# EAGLE design main_board_2_layers_v2 (EAGLE 7.4.0)
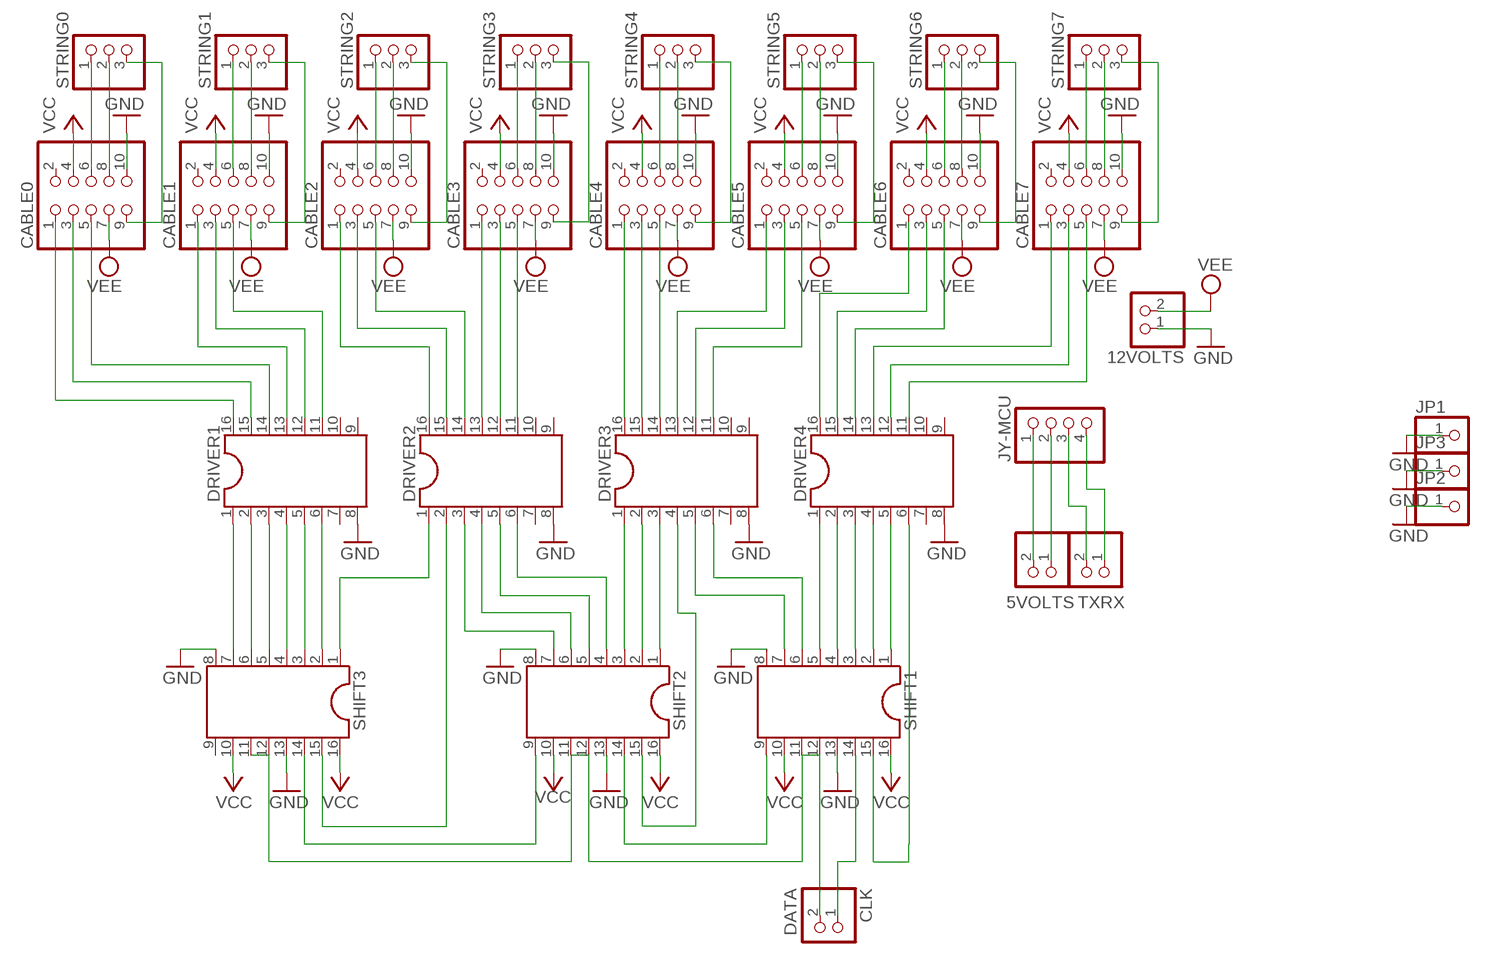
[diagram p0: schematic, sheet 1]

## Parts
5VOLTS  PINHD-1X2  [1X02]
12VOLTS  PINHD-1X2  [1X02]
CABLE0  PINHD-2X5  [2X05]
CABLE1  PINHD-2X5  [2X05]
CABLE2  PINHD-2X5  [2X05]
CABLE3  PINHD-2X5  [2X05]
CABLE4  PINHD-2X5  [2X05]
CABLE5  PINHD-2X5  [2X05]
CABLE6  PINHD-2X5  [2X05]
CABLE7  PINHD-2X5  [2X05]
CLK  DATA  PINHD-1X2  [1X02]
DRIVER1  DIL16  [DIL16]
DRIVER2  DIL16  [DIL16]
DRIVER3  DIL16  [DIL16]
DRIVER4  DIL16  [DIL16]
JP1  PINHD-1X1  [1X01]
JP2  PINHD-1X1  [1X01]
JP3  PINHD-1X1  [1X01]
JY-MCU  PINHD-1X4  [1X04]
SHIFT1  DIL16  [DIL16]
SHIFT2  DIL16  [DIL16]
SHIFT3  DIL16  [DIL16]
STRING0  PINHD-1X3  [1X03]
STRING1  PINHD-1X3  [1X03]
STRING2  PINHD-1X3  [1X03]
STRING3  PINHD-1X3  [1X03]
STRING4  PINHD-1X3  [1X03]
STRING5  PINHD-1X3  [1X03]
STRING6  PINHD-1X3  [1X03]
STRING7  PINHD-1X3  [1X03]
TXRX  PINHD-1X2  [1X02]

## Nets
GND: 12VOLTS.1 CABLE0.10 CABLE1.10 CABLE2.10 CABLE3.10 CABLE4.10 CABLE5.10 CABLE6.10 CABLE7.10 DRIVER1.8 DRIVER2.8 DRIVER3.8 DRIVER4.8 JP1.1 JP2.1 JP3.1 SHIFT1.8 SHIFT1.13 SHIFT2.8 SHIFT2.13 SHIFT3.8 SHIFT3.13
N$1: CABLE0.1 DRIVER1.16
N$2: CABLE0.3 DRIVER1.15
N$3: CABLE0.5 DRIVER1.14
N$4: CABLE1.1 DRIVER1.13
N$5: CABLE1.3 DRIVER1.12
N$6: CABLE1.5 DRIVER1.11
N$7: CABLE2.1 DRIVER2.16
N$8: CABLE2.3 DRIVER2.15
N$9: CABLE2.5 DRIVER2.14
N$10: CABLE3.1 DRIVER2.13
N$11: CABLE3.3 DRIVER2.12
N$12: CABLE3.5 DRIVER2.11
N$13: CABLE4.1 DRIVER3.16
N$14: CABLE4.3 DRIVER3.15
N$15: CABLE4.5 DRIVER3.14
N$16: CABLE5.1 DRIVER3.13
N$17: CABLE5.3 DRIVER3.12
N$18: CABLE5.5 DRIVER3.11
N$19: CABLE6.1 DRIVER4.16
N$20: CABLE6.3 DRIVER4.15
N$21: CABLE7.1 DRIVER4.13
N$22: CABLE6.5 DRIVER4.14
N$23: CABLE7.3 DRIVER4.12
N$24: CABLE7.5 DRIVER4.11
N$25: DRIVER4.6
N$26: DRIVER4.5 SHIFT1.1
N$27: DRIVER4.4 SHIFT1.2
N$28: CABLE1.9 STRING1.3
N$29: CABLE0.6 STRING0.1
N$30: CABLE0.9 STRING0.3
N$31: CABLE0.8 STRING0.2
N$32: CABLE7.6 STRING7.1
N$33: CABLE7.8 STRING7.2
N$34: CABLE1.6 STRING1.1
N$35: CABLE1.8 STRING1.2
N$36: CABLE7.9 STRING7.3
N$37: CABLE2.8 STRING2.2
N$38: CABLE2.6 STRING2.1
N$39: CABLE3.9 STRING3.3
N$40: CABLE3.8 STRING3.2
N$41: CABLE3.6 STRING3.1
N$42: CABLE4.9 STRING4.3
N$43: CABLE4.8 STRING4.2
N$44: CABLE4.6 STRING4.1
N$45: CABLE5.9 STRING5.3
N$46: CABLE5.6 STRING5.1
N$47: CABLE5.8 STRING5.2
N$48: CABLE6.9 STRING6.3
N$49: CABLE6.6 STRING6.1
N$50: CABLE6.8 STRING6.2
N$51: SHIFT1.15
N$52: DRIVER4.3 SHIFT1.3
N$53: DRIVER4.2 SHIFT1.4
N$54: DRIVER4.1 SHIFT1.5
N$55: DRIVER3.6 SHIFT1.6
N$56: DRIVER3.5 SHIFT1.7
N$57: DRIVER3.4 SHIFT2.15
N$58: DRIVER3.3 SHIFT2.1
N$59: DRIVER3.2 SHIFT2.2
N$60: DRIVER3.1 SHIFT2.3
N$61: DRIVER2.6 SHIFT2.4
N$62: DRIVER2.5 SHIFT2.5
N$63: DRIVER2.4 SHIFT2.6
N$64: DRIVER2.3 SHIFT2.7
N$65: DRIVER2.2 SHIFT3.15
N$66: DRIVER2.1 SHIFT3.1
N$67: DRIVER1.1 SHIFT3.7
N$69: DRIVER1.2 SHIFT3.6
N$70: DRIVER1.3 SHIFT3.5
N$71: DRIVER1.4 SHIFT3.4
N$72: DRIVER1.5 SHIFT3.3
N$73: DRIVER1.6 SHIFT3.2
N$81: 5VOLTS.2 JY-MCU.1
N$82: 5VOLTS.1 JY-MCU.2
N$83: JY-MCU.3 TXRX.2
N$101: SHIFT1.9 SHIFT2.14
N$102: SHIFT2.9 SHIFT3.14
N$106: CLK.1 SHIFT1.14
N$107: CLK.2 SHIFT1.11 SHIFT1.12 SHIFT2.11 SHIFT2.12 SHIFT3.11 SHIFT3.12
N$118: CABLE2.9 STRING2.3
N$119: JY-MCU.4 TXRX.1
VCC: CABLE0.4 CABLE1.4 CABLE2.4 CABLE3.4 CABLE4.4 CABLE5.4 CABLE6.4 CABLE7.4 SHIFT1.10 SHIFT1.16 SHIFT2.10 SHIFT2.16 SHIFT3.10 SHIFT3.16
VEE: 12VOLTS.2 CABLE0.7 CABLE1.7 CABLE2.7 CABLE3.7 CABLE4.7 CABLE5.7 CABLE6.7 CABLE7.7
Unconnected: CABLE0.2 CABLE1.2 CABLE2.2 CABLE3.2 CABLE4.2 CABLE5.2 CABLE6.2 CABLE7.2 DRIVER1.7 DRIVER1.9 DRIVER1.10 DRIVER2.7 DRIVER2.9 DRIVER2.10 DRIVER3.7 DRIVER3.9 DRIVER3.10 DRIVER4.7 DRIVER4.9 DRIVER4.10 SHIFT3.9

## Library data of the parts
5VOLTS 12VOLTS CLK TXRX = pinhead:PINHD-1X2: PIN HEADER
CABLE0 CABLE1-CABLE7 = pinhead:PINHD-2X5: PIN HEADER
DRIVER1-DRIVER4 SHIFT1-SHIFT3 = ic-package:DIL16: Dual In Line / Socket
JP1-JP3 = adafruit:PINHD-1X1: Pin header 1x1 for 0.1" spacing With round pins
JY-MCU = pinhead:PINHD-1X4: PIN HEADER
STRING0 STRING1-STRING7 = pinhead:PINHD-1X3: PIN HEADER

## Net classes
0 default: width 1 mm, drill 1.1 mm, clearance 1 mm

## Board
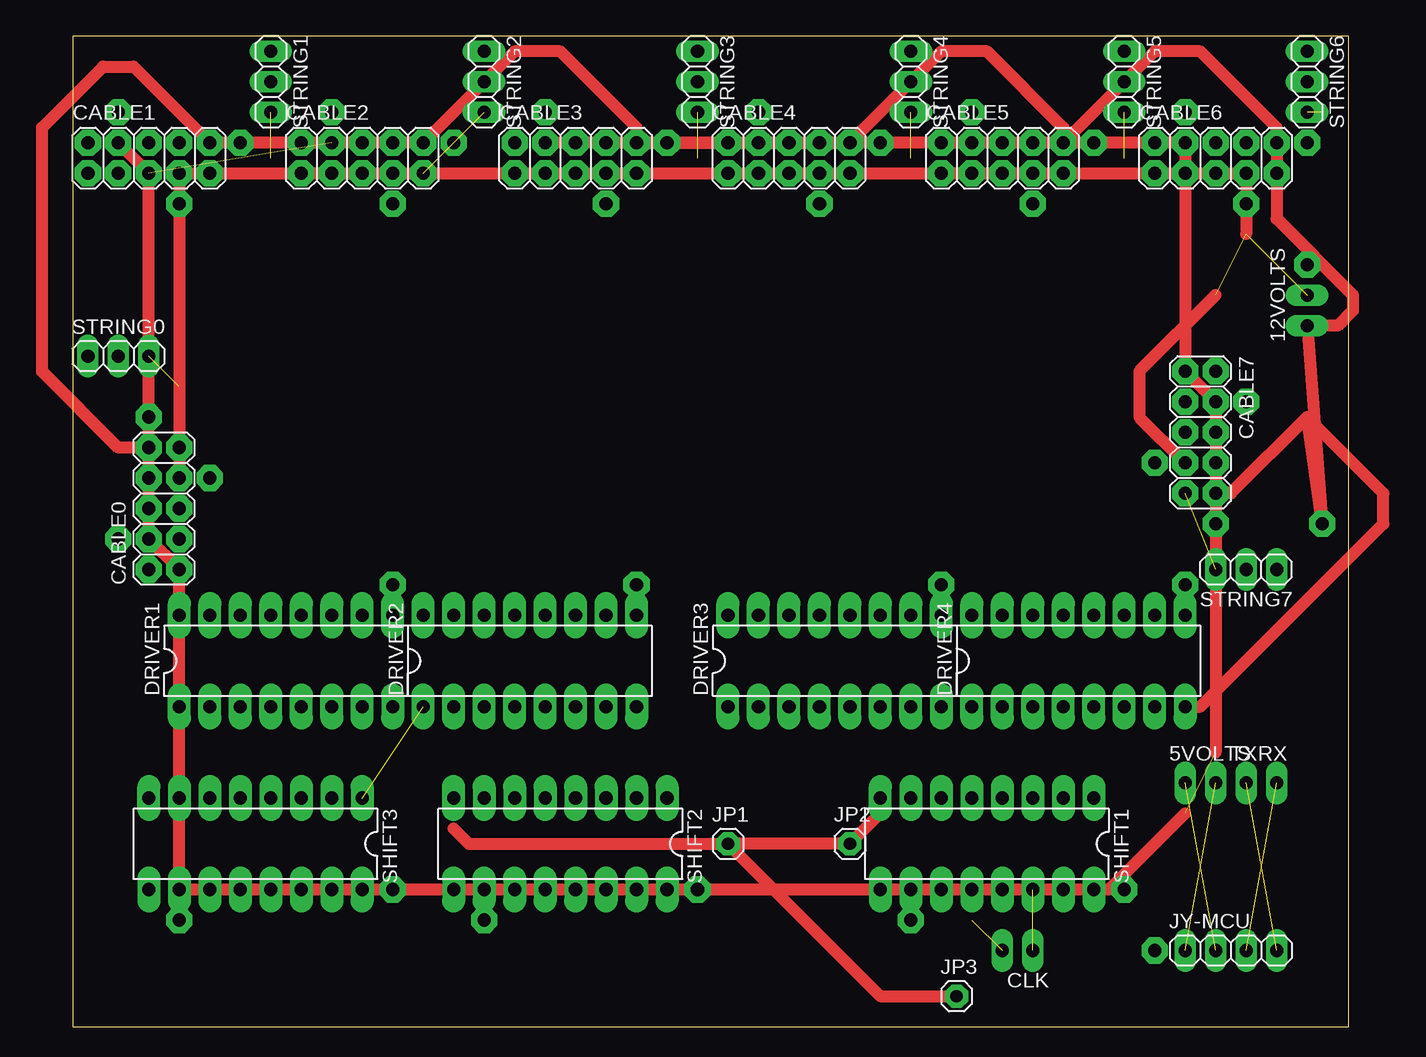
[diagram p1: board, top side]
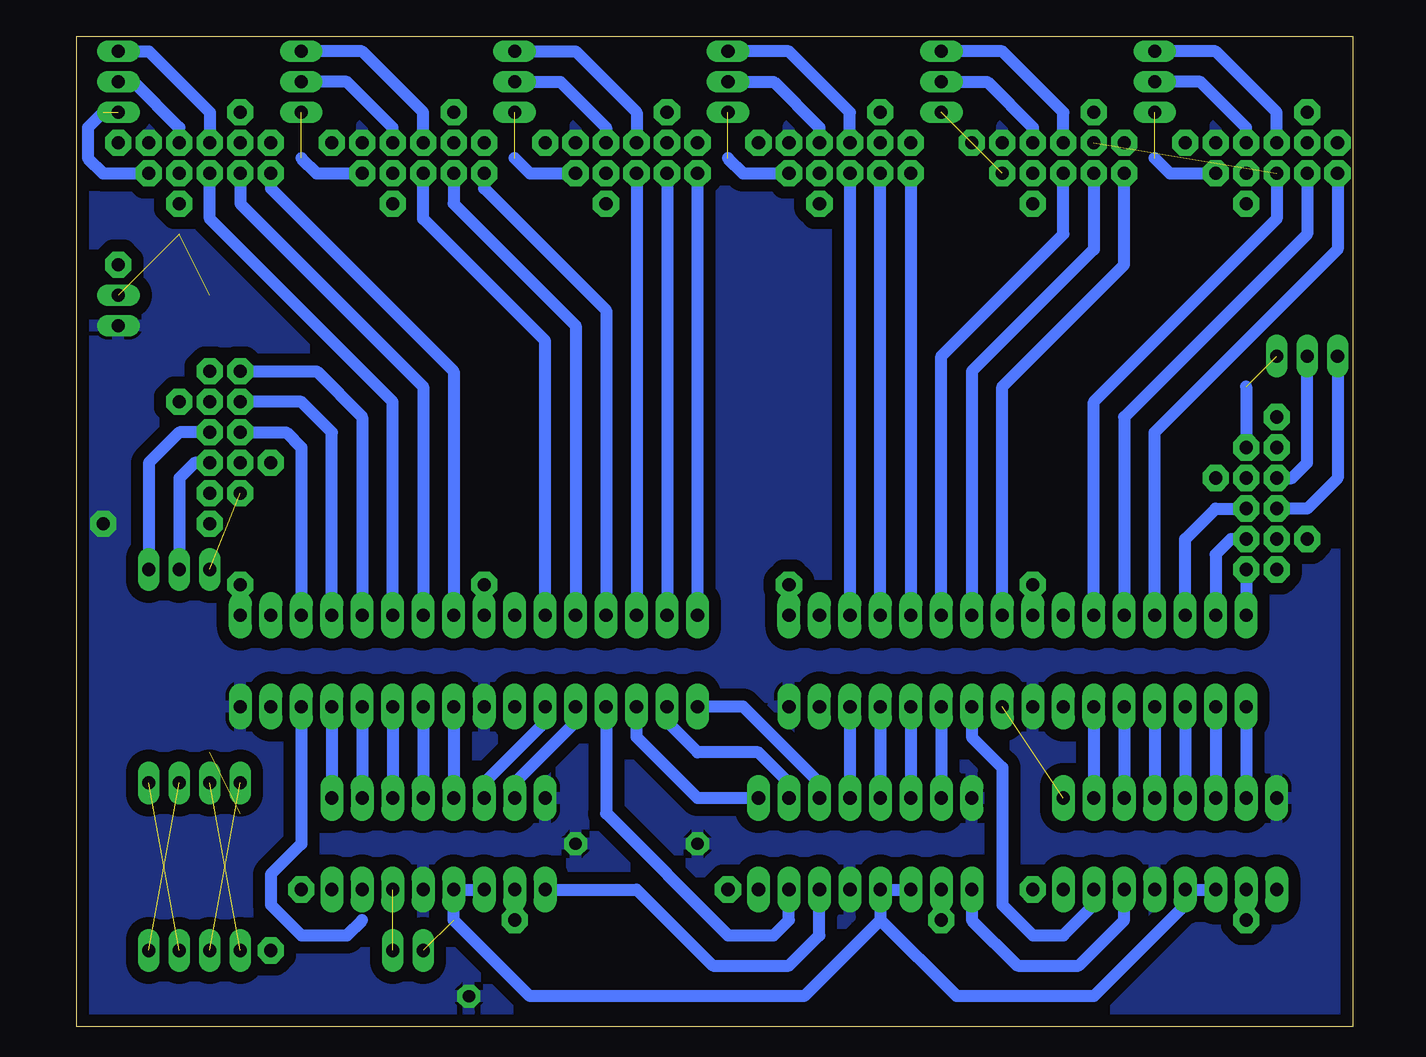
[diagram p2: board, bottom side, seen from below]

Size 106.35 x 82.54 mm. Coordinates in mm from the lower left corner, seen from the top.
Outline: 0,0 106.35,0 106.35,82.54 0,82.54 0,0
Copper layers (1*16): Top 0.035mm / dielectric 1.5mm / Bottom 0.035mm
Design rules "default": minimum track width 10mil, minimum drill 24mil, track to track 8mil, track to pad 8mil, pad to pad 8mil, via to via 8mil, smd to smd 8mil, copper to edge 40mil, drill to drill 8mil, minimum pad ring 10mil, minimum via ring 8mil, stop-mask expansion 4mil, vias tented up to drill 0mil, thermal gap 10mil

### Footprints (pad centres in the part's own frame; a part is rotated, then mirrored left to right if it is on the bottom)
1X02 = drill 1.1 pad 1.778 long: 1 -1.27,0; 2 1.27,0
2X05 = drill 1.1 pad 2.184 octagon: 1 -5.08,-1.27; 2 -5.08,1.27; 3 -2.54,-1.27; 4 -2.54,1.27; 5 0,-1.27; 6 0,1.27; 7 2.54,-1.27; 8 2.54,1.27; 9 5.08,-1.27; 10 5.08,1.27
DIL16 = drill 1.1 pad 1.93 long: 1 -8.89,-3.81; 2 -6.35,-3.81; 3 -3.81,-3.81; 4 -1.27,-3.81; 5 1.27,-3.81; 6 3.81,-3.81; 7 6.35,-3.81; 8 8.89,-3.81; 9 8.89,3.81; 10 6.35,3.81; 11 3.81,3.81; 12 1.27,3.81; 13 -1.27,3.81; 14 -3.81,3.81; 15 -6.35,3.81; 16 -8.89,3.81
1X01 = drill 1.016 pad 1.93 octagon: 1 0,0
1X04 = drill 1.1 pad 1.778 long: 1 -3.81,0; 2 -1.27,0; 3 1.27,0; 4 3.81,0
1X03 = drill 1.1 pad 1.778 long: 1 -2.54,0; 2 0,0; 3 2.54,0

### Placement (x,y rotation side)
5VOLTS  93.98,20.32 0 top
12VOLTS  102.87,59.69 90 top
CABLE0  7.62,43.18 90 top
CABLE1  6.35,72.39 0 top
CABLE2  24.13,72.39 0 top
CABLE3  41.91,72.39 0 top
CABLE4  59.69,72.39 0 top
CABLE5  77.47,72.39 0 top
CABLE6  95.25,72.39 0 top
CABLE7  93.98,49.53 270 top
CLK  78.74,6.35 180 top
DRIVER1  17.78,30.48 0 top
DRIVER2  38.1,30.48 0 top
DRIVER3  63.5,30.48 0 top
DRIVER4  83.82,30.48 0 top
JP1  54.61,15.24 0 top
JP2  64.77,15.24 0 top
JP3  73.66,2.54 0 top
JY-MCU  96.52,6.35 0 top
SHIFT1  76.2,15.24 180 top
SHIFT2  40.64,15.24 180 top
SHIFT3  15.24,15.24 180 top
STRING0  3.81,55.88 0 top
STRING1  16.51,78.74 270 top
STRING2  34.29,78.74 270 top
STRING3  52.07,78.74 270 top
STRING4  69.85,78.74 270 top
STRING5  87.63,78.74 270 top
STRING6  102.87,78.74 270 top
STRING7  97.79,38.1 180 top
TXRX  99.06,20.32 0 top

### Tracks (layer width: path | path; a pad name or v marks a point on that pad's centre or on a via)
GND  (via drill 1.1 pad 2.18)
  Top 1.016: CABLE0.10 3.81,48.26 -2.54,54.61 -2.54,74.93 2.54,80.01 5.08,80.01 CABLE1.10 CABLE2.10 36.83,81.28 40.64,81.28 46.99,74.93 CABLE3.10 CABLE4.10 72.39,81.28 76.2,81.28 82.55,74.93 CABLE5.10 90.17,81.28 93.98,81.28 100.33,74.93 CABLE6.10 100.33,67.31 106.68,60.96 106.68,59.69 105.41,58.42 12VOLTS.1 v104.14,41.91 102.87,50.8 | 67.31,17.78 JP2.1 JP1.1 | 31.75,16.51 33.02,15.24 JP1.1 | JP1.1 67.31,2.54 JP3.1 | 102.87,50.8 96.52,44.45 CABLE7.10 | DRIVER4.8 93.98,26.67 109.22,41.91 109.22,44.45 102.87,50.8
  pour Bottom: 0,82.55 0,0 106.68,0 106.68,83.82
N$1
  Bottom 1.016: CABLE0.1 DRIVER1.16
N$2
  Bottom 1.016: CABLE0.3 10.16,40.64 11.43,39.37 DRIVER1.15
N$3
  Bottom 1.016: DRIVER1.14 13.97,40.64 11.43,43.18 CABLE0.5
N$4
  Bottom 1.016: CABLE1.1 1.27,64.77 16.51,49.53 DRIVER1.13
N$5
  Bottom 1.016: CABLE1.3 3.81,66.04 19.05,50.8 DRIVER1.12
N$6
  Bottom 1.016: CABLE1.5 6.35,67.31 21.59,52.07 DRIVER1.11
N$7
  Bottom 1.016: DRIVER2.16 29.21,53.34 19.05,63.5 CABLE2.1
N$8
  Bottom 1.016: CABLE2.3 21.59,64.77 31.75,54.61 DRIVER2.15
N$9
  Bottom 1.016: DRIVER2.14 34.29,55.88 24.13,66.04 CABLE2.5
N$10
  Bottom 1.016: CABLE3.1 DRIVER2.13
N$11
  Bottom 1.016: DRIVER2.12 CABLE3.3
N$12
  Bottom 1.016: CABLE3.5 DRIVER2.11
N$13
  Bottom 1.016: DRIVER3.16 CABLE4.1
N$14
  Bottom 1.016: CABLE4.3 DRIVER3.15
N$15
  Bottom 1.016: CABLE4.5 DRIVER3.14
N$16
  Bottom 1.016: CABLE5.1 72.39,69.85 62.23,59.69 DRIVER3.13
N$17
  Bottom 1.016: CABLE5.3 74.93,68.58 64.77,58.42 DRIVER3.12
N$18
  Bottom 1.016: DRIVER3.11 67.31,57.15 77.47,67.31 CABLE5.5
N$19
  Bottom 1.016: CABLE6.1 90.17,69.85 74.93,54.61 DRIVER4.16
N$20
  Bottom 1.016: CABLE6.3 92.71,68.58 77.47,53.34 DRIVER4.15
N$21
  Bottom 1.016: CABLE7.1 86.36,54.61 82.55,50.8 DRIVER4.13
N$22
  Bottom 1.016: DRIVER4.14 80.01,52.07 95.25,67.31 CABLE6.5
N$23
  Bottom 1.016: DRIVER4.12 85.09,49.53 87.63,52.07 CABLE7.3
N$24
  Bottom 1.016: CABLE7.5 88.9,49.53 87.63,48.26 DRIVER4.11
N$25
  Bottom 1.016: DRIVER4.6 87.63,15.24 90.17,12.7 90.17,10.16 87.63,7.62 83.82,7.62 82.55,8.89
N$26
  Bottom 1.016: DRIVER4.5 SHIFT1.1
N$27
  Bottom 1.016: DRIVER4.4 SHIFT1.2
N$28  (1 unrouted)
  Bottom 1.016: 16.51,72.39 15.24,71.12 CABLE1.9
N$29
  Bottom 1.016: STRING0.1 1.27,45.72 3.81,43.18 CABLE0.6
N$30  (1 unrouted)
  Bottom 1.016: 8.89,53.34 CABLE0.9
N$31
  Bottom 1.016: CABLE0.8 5.08,45.72 3.81,46.99 STRING0.2
N$32
  Bottom 1.016: CABLE7.6 97.79,49.53 100.33,46.99 STRING7.1
N$33
  Bottom 1.016: CABLE7.8 96.52,46.99 97.79,45.72 STRING7.2
N$34
  Bottom 1.016: CABLE1.6 6.35,76.2 11.43,81.28 STRING1.1
N$35
  Bottom 1.016: CABLE1.8 8.89,74.93 12.7,78.74 STRING1.2
N$36  (1 unrouted)
N$37
  Bottom 1.016: STRING2.2 30.48,78.74 26.67,74.93 CABLE2.8
N$38
  Bottom 1.016: CABLE2.6 24.13,76.2 29.21,81.28 STRING2.1
N$39  (1 unrouted)
  Bottom 1.016: 52.07,72.39 50.8,71.12 CABLE3.9
N$40
  Bottom 1.016: STRING3.2 48.26,78.74 44.45,74.93 CABLE3.8
N$41
  Bottom 1.016: CABLE3.6 41.91,76.2 46.99,81.28 STRING3.1
N$42  (1 unrouted)
  Bottom 1.016: 69.85,72.39 68.58,71.12 CABLE4.9
N$43
  Bottom 1.016: STRING4.2 66.04,78.74 62.23,74.93 CABLE4.8
N$44
  Bottom 1.016: STRING4.1 64.77,81.28 59.69,76.2 CABLE4.6
N$45  (1 unrouted)
  Bottom 1.016: 87.63,72.39 86.36,71.12 CABLE5.9
N$46
  Bottom 1.016: CABLE5.6 77.47,76.2 82.55,81.28 STRING5.1
N$47
  Bottom 1.016: CABLE5.8 80.01,74.93 83.82,78.74 STRING5.2
N$48  (1 unrouted)
  Bottom 1.016: 104.14,76.2 105.41,74.93 105.41,72.39 104.14,71.12 CABLE6.9
N$49
  Bottom 1.016: STRING6.1 100.33,81.28 95.25,76.2 CABLE6.6
N$50
  Bottom 1.016: CABLE6.8 97.79,74.93 101.6,78.74 STRING6.2
N$52
  Bottom 1.016: DRIVER4.3 SHIFT1.3
N$53
  Bottom 1.016: DRIVER4.2 SHIFT1.4
N$54
  Bottom 1.016: DRIVER4.1 SHIFT1.5
N$55
  Bottom 1.016: SHIFT1.6 72.39,20.32 67.31,25.4 DRIVER3.6
N$56
  Bottom 1.016: DRIVER3.5 64.77,25.4 69.85,20.32 SHIFT1.7
N$57
  Bottom 1.016: DRIVER3.4 62.23,17.78 52.07,7.62 48.26,7.62 46.99,8.89 SHIFT2.15
N$58
  Bottom 1.016: SHIFT2.1 54.61,19.05 59.69,24.13 DRIVER3.3
N$59
  Bottom 1.016: SHIFT2.2 46.99,20.32 49.53,22.86 54.61,22.86 57.15,25.4 DRIVER3.2
N$60
  Bottom 1.016: SHIFT2.3 44.45,20.32 50.8,26.67 DRIVER3.1
N$61
  Bottom 1.016: DRIVER2.6 SHIFT2.4
N$62
  Bottom 1.016: DRIVER2.5 SHIFT2.5
N$63
  Bottom 1.016: DRIVER2.4 SHIFT2.6
N$64
  Bottom 1.016: DRIVER2.3 SHIFT2.7
N$65
  Bottom 1.016: DRIVER2.2 31.75,24.13 29.21,21.59 29.21,10.16 26.67,7.62 24.13,7.62 21.59,10.16 SHIFT3.15
N$66  (1 unrouted)
N$67
  Bottom 1.016: DRIVER1.1 SHIFT3.7
N$69
  Bottom 1.016: DRIVER1.2 SHIFT3.6
N$70
  Bottom 1.016: DRIVER1.3 SHIFT3.5
N$71
  Bottom 1.016: DRIVER1.4 SHIFT3.4
N$72
  Bottom 1.016: DRIVER1.5 SHIFT3.3
N$73
  Bottom 1.016: DRIVER1.6 SHIFT3.2
N$74  (via drill 1.1 pad 2.18)
  other vias: 97.79,52.07
N$75  (via drill 1.1 pad 2.18)
  other vias: 92.71,76.2
N$76  (via drill 1.1 pad 2.18)
  other vias: 74.93,76.2
N$78  (via drill 1.1 pad 2.18)
  other vias: 57.15,76.2
N$79  (via drill 1.1 pad 2.18)
  other vias: 39.37,76.2
N$80  (via drill 1.1 pad 2.18)
  other vias: 21.59,76.2
N$81  (1 unrouted)
N$82  (1 unrouted)
N$83  (1 unrouted)
N$84  (via drill 1.1 pad 2.18)
  other vias: 3.81,76.2
N$85  (via drill 1.1 pad 2.18)
  other vias: 3.81,40.64
N$86  (via drill 1.1 pad 2.18)
  other vias: 95.25,41.91
N$87  (via drill 1.1 pad 2.18)
  other vias: 90.17,46.99
N$88  (via drill 1.1 pad 2.18)
  other vias: 97.79,68.58
N$89  (via drill 1.1 pad 2.18)
  other vias: 62.23,68.58
N$90  (via drill 1.1 pad 2.18)
  other vias: 26.67,68.58
N$91  (via drill 1.1 pad 2.18)
  other vias: 8.89,68.58
N$92  (via drill 1.1 pad 2.18)
  other vias: 11.43,45.72
N$93  (via drill 1.1 pad 2.18)
  other vias: 80.01,68.58
N$94  (via drill 1.1 pad 2.18)
  other vias: 44.45,68.58
N$95  (via drill 1.1 pad 2.18)
  other vias: 6.35,50.8
N$96  (via drill 1.1 pad 2.18)
  other vias: 90.17,6.35
N$97  (via drill 1.1 pad 2.18)
  other vias: 34.29,8.89
N$98  (via drill 1.1 pad 2.18)
  other vias: 52.07,11.43
N$99  (via drill 1.1 pad 2.18)
  other vias: 87.63,11.43
N$100  (via drill 1.1 pad 2.18)
  other vias: 69.85,8.89
N$101
  Bottom 1.016: SHIFT1.9 59.69,11.43 53.34,5.08 46.99,5.08 44.45,7.62 SHIFT2.14
N$102
  Bottom 1.016: SHIFT2.9 31.75,8.89 27.94,5.08 22.86,5.08 19.05,8.89 SHIFT3.14
N$103  (via drill 1.1 pad 2.18)
  other vias: 8.89,8.89
N$104  (via drill 1.1 pad 2.18)
  other vias: 26.67,11.43
N$105  (via drill 1.1 pad 2.18)
  other vias: 26.67,36.83
N$106  (1 unrouted)
N$107  (1 unrouted)
  Bottom 1.016: SHIFT1.11 SHIFT1.12 74.93,8.89 68.58,2.54 45.72,2.54 39.37,8.89 | SHIFT2.11 SHIFT2.12 39.37,8.89 | SHIFT3.11 SHIFT3.12 13.97,10.16 21.59,2.54 33.02,2.54 39.37,8.89
N$108  (via drill 1.1 pad 2.18)
  other vias: 46.99,36.83
N$109  (via drill 1.1 pad 2.18)
  other vias: 72.39,36.83
N$110  (via drill 1.1 pad 2.18)
  other vias: 92.71,36.83
N$111  (via drill 1.1 pad 2.18)
  other vias: 31.75,73.66
N$112  (via drill 1.1 pad 2.18)
  other vias: 49.53,73.66
N$113  (via drill 1.1 pad 2.18)
  other vias: 85.09,73.66
N$114  (via drill 1.1 pad 2.18)
  other vias: 67.31,73.66
N$115  (via drill 1.1 pad 2.18)
  other vias: 13.97,73.66
N$116  (via drill 1.1 pad 2.18)
  other vias: 102.87,73.66
N$117  (via drill 1.1 pad 2.18)
  other vias: 102.87,63.5
N$118  (1 unrouted)
N$119  (1 unrouted)
VCC  (2 unrouted)
  Top 1.016: 92.71,17.78 86.36,11.43 SHIFT1.16 SHIFT1.10 SHIFT2.16 SHIFT2.10 SHIFT3.16 SHIFT3.10 8.89,38.1 CABLE0.4 6.35,71.12 CABLE1.4 | CABLE3.4 CABLE4.4 CABLE5.4 CABLE6.4 92.71,54.61 CABLE7.4 95.25,22.86
VEE  (2 unrouted)
  Top 1.016: CABLE0.7 CABLE1.7 CABLE2.7 CABLE3.7 CABLE4.7 CABLE5.7 CABLE6.7 97.79,66.04 | 95.25,60.96 88.9,54.61 88.9,50.8 CABLE7.7